# Altium schematic sheet MODULE_SAIL.SchDoc: MODULE SAIL
size A3; Author: Silvio Navaretti; CompanyName: ARDUINO; DrawnBy: Silvio Navaretti; Engineer: Silvio Navaretti; Organization: ARDUINO; SheetNumber: 4; SheetTotal: 51; RevAuthor: Silvio Navaretti
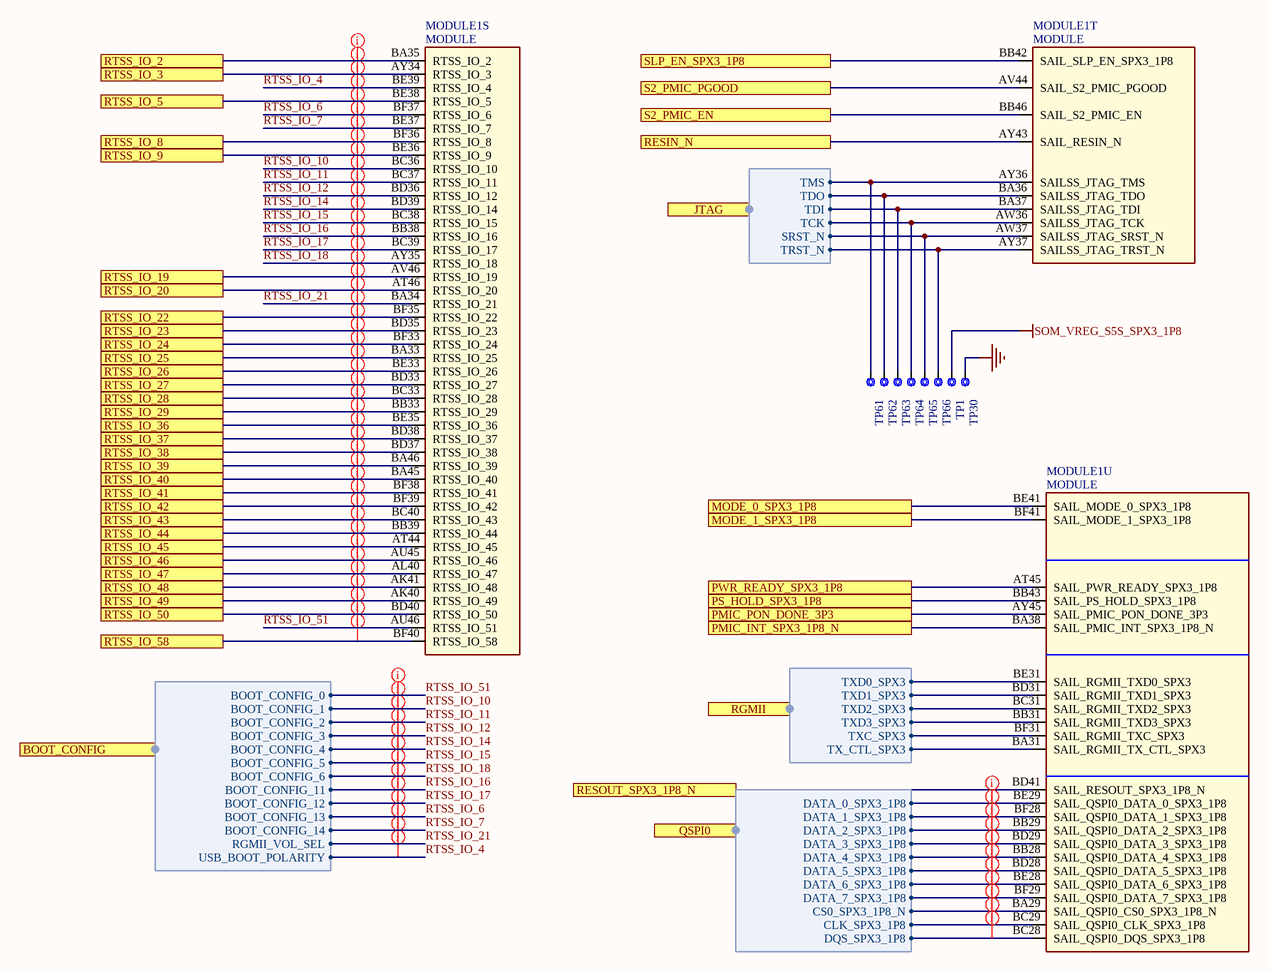
[diagram p0: MODULE_SAIL.SchDoc]

## Parts
MODULE1  MODULE  [MODULE]  (parts S,T,U of 22)
TP1  Test point 1.00mm  [TP-1.00MM]  (value not drawn)  (no BOM)
TP30  Test point 1.00mm  [TP-1.00MM]  (value not drawn)  (no BOM)
TP61  Test point 1.00mm  [TP-1.00MM]  (value not drawn)  (no BOM)
TP62  Test point 1.00mm  [TP-1.00MM]  (value not drawn)  (no BOM)
TP63  Test point 1.00mm  [TP-1.00MM]  (value not drawn)  (no BOM)
TP64  Test point 1.00mm  [TP-1.00MM]  (value not drawn)  (no BOM)
TP65  Test point 1.00mm  [TP-1.00MM]  (value not drawn)  (no BOM)
TP66  Test point 1.00mm  [TP-1.00MM]  (value not drawn)  (no BOM)

## Ports
BOOT_CONFIG (harness SOM_SAIL_BOOT_CONFIG), JTAG (harness SOM_SAIL_JTAG), MODE_0_SPX3_1P8, MODE_1_SPX3_1P8, PMIC_INT_SPX3_1P8_N, PMIC_PON_DONE_3P3, PS_HOLD_SPX3_1P8, PWR_READY_SPX3_1P8, QSPI0 (harness SOM_SAIL_QSPI0), RESIN_N, RESOUT_SPX3_1P8_N, RGMII (harness SOM_SAIL_RGMII), RTSS_IO_2, RTSS_IO_3, RTSS_IO_5, RTSS_IO_8, RTSS_IO_9, RTSS_IO_19, RTSS_IO_20, RTSS_IO_22, RTSS_IO_23, RTSS_IO_24, RTSS_IO_25, RTSS_IO_26, RTSS_IO_27, RTSS_IO_28, RTSS_IO_29, RTSS_IO_36, RTSS_IO_37, RTSS_IO_38, RTSS_IO_39, RTSS_IO_40, RTSS_IO_41, RTSS_IO_42, RTSS_IO_43, RTSS_IO_44, RTSS_IO_45, RTSS_IO_46, RTSS_IO_47, RTSS_IO_48, RTSS_IO_49, RTSS_IO_50, RTSS_IO_58, S2_PMIC_EN, S2_PMIC_PGOOD, SLP_EN_SPX3_1P8

## Harnesses
SOM_SAIL_JTAG: TMS, TDO, TDI, TCK, SRST_N, TRST_N
SOM_SAIL_RGMII: TXD0_SPX3, TXD1_SPX3, TXD2_SPX3, TXD3_SPX3, TXC_SPX3, TX_CTL_SPX3
SOM_SAIL_QSPI0: DATA_0_SPX3_1P8, DATA_1_SPX3_1P8, DATA_2_SPX3_1P8, DATA_3_SPX3_1P8, DATA_4_SPX3_1P8, DATA_5_SPX3_1P8, DATA_6_SPX3_1P8, DATA_7_SPX3_1P8, CS0_SPX3_1P8_N, CLK_SPX3_1P8, DQS_SPX3_1P8
SOM_SAIL_BOOT_CONFIG: BOOT_CONFIG_0, BOOT_CONFIG_1, BOOT_CONFIG_2, BOOT_CONFIG_3, BOOT_CONFIG_4, BOOT_CONFIG_5, BOOT_CONFIG_6, BOOT_CONFIG_11, BOOT_CONFIG_12, BOOT_CONFIG_13, BOOT_CONFIG_14, RGMII_VOL_SEL, USB_BOOT_POLARITY

## Nets
GND: TP30.X
SOM_VREG_S5S_SPX3_1P8: TP1.X
MODE_0_SPX3_1P8: MODULE1.BE41(SAIL_MODE_0_SPX3_1P8) ; port MODE_0_SPX3_1P8
MODE_1_SPX3_1P8: MODULE1.BF41(SAIL_MODE_1_SPX3_1P8) ; port MODE_1_SPX3_1P8
PMIC_INT_SPX3_1P8_N: MODULE1.BA38(SAIL_PMIC_INT_SPX3_1P8_N) ; port PMIC_INT_SPX3_1P8_N
PMIC_PON_DONE_3P3: MODULE1.AY45(SAIL_PMIC_PON_DONE_3P3) ; port PMIC_PON_DONE_3P3
PS_HOLD_SPX3_1P8: MODULE1.BB43(SAIL_PS_HOLD_SPX3_1P8) ; port PS_HOLD_SPX3_1P8
PWR_READY_SPX3_1P8: MODULE1.AT45(SAIL_PWR_READY_SPX3_1P8) ; port PWR_READY_SPX3_1P8
RESIN_N: MODULE1.AY43(SAIL_RESIN_N) ; port RESIN_N
RESOUT_SPX3_1P8_N: MODULE1.BD41(SAIL_RESOUT_SPX3_1P8_N) ; port RESOUT_SPX3_1P8_N
RTSS_IO_2: MODULE1.BA35(RTSS_IO_2) ; port RTSS_IO_2
RTSS_IO_3: MODULE1.AY34(RTSS_IO_3) ; port RTSS_IO_3
RTSS_IO_4: MODULE1.BE39(RTSS_IO_4) ; port BOOT_CONFIG.USB_BOOT_POLARITY
RTSS_IO_5: MODULE1.BE38(RTSS_IO_5) ; port RTSS_IO_5
RTSS_IO_6: MODULE1.BF37(RTSS_IO_6) ; port BOOT_CONFIG.BOOT_CONFIG_13
RTSS_IO_7: MODULE1.BE37(RTSS_IO_7) ; port BOOT_CONFIG.BOOT_CONFIG_14
RTSS_IO_8: MODULE1.BF36(RTSS_IO_8) ; port RTSS_IO_8
RTSS_IO_9: MODULE1.BE36(RTSS_IO_9) ; port RTSS_IO_9
RTSS_IO_10: MODULE1.BC36(RTSS_IO_10) ; port BOOT_CONFIG.BOOT_CONFIG_1
RTSS_IO_11: MODULE1.BC37(RTSS_IO_11) ; port BOOT_CONFIG.BOOT_CONFIG_2
RTSS_IO_12: MODULE1.BD36(RTSS_IO_12) ; port BOOT_CONFIG.BOOT_CONFIG_3
RTSS_IO_14: MODULE1.BD39(RTSS_IO_14) ; port BOOT_CONFIG.BOOT_CONFIG_4
RTSS_IO_15: MODULE1.BC38(RTSS_IO_15) ; port BOOT_CONFIG.BOOT_CONFIG_5
RTSS_IO_16: MODULE1.BB38(RTSS_IO_16) ; port BOOT_CONFIG.BOOT_CONFIG_11
RTSS_IO_17: MODULE1.BC39(RTSS_IO_17) ; port BOOT_CONFIG.BOOT_CONFIG_12
RTSS_IO_18: MODULE1.AY35(RTSS_IO_18) ; port BOOT_CONFIG.BOOT_CONFIG_6
RTSS_IO_19: MODULE1.AV46(RTSS_IO_19) ; port RTSS_IO_19
RTSS_IO_20: MODULE1.AT46(RTSS_IO_20) ; port RTSS_IO_20
RTSS_IO_21: MODULE1.BA34(RTSS_IO_21) ; port BOOT_CONFIG.RGMII_VOL_SEL
RTSS_IO_22: MODULE1.BF35(RTSS_IO_22) ; port RTSS_IO_22
RTSS_IO_23: MODULE1.BD35(RTSS_IO_23) ; port RTSS_IO_23
RTSS_IO_24: MODULE1.BF33(RTSS_IO_24) ; port RTSS_IO_24
RTSS_IO_25: MODULE1.BA33(RTSS_IO_25) ; port RTSS_IO_25
RTSS_IO_26: MODULE1.BE33(RTSS_IO_26) ; port RTSS_IO_26
RTSS_IO_27: MODULE1.BD33(RTSS_IO_27) ; port RTSS_IO_27
RTSS_IO_28: MODULE1.BC33(RTSS_IO_28) ; port RTSS_IO_28
RTSS_IO_29: MODULE1.BB33(RTSS_IO_29) ; port RTSS_IO_29
RTSS_IO_36: MODULE1.BE35(RTSS_IO_36) ; port RTSS_IO_36
RTSS_IO_37: MODULE1.BD38(RTSS_IO_37) ; port RTSS_IO_37
RTSS_IO_38: MODULE1.BD37(RTSS_IO_38) ; port RTSS_IO_38
RTSS_IO_39: MODULE1.BA46(RTSS_IO_39) ; port RTSS_IO_39
RTSS_IO_40: MODULE1.BA45(RTSS_IO_40) ; port RTSS_IO_40
RTSS_IO_41: MODULE1.BF38(RTSS_IO_41) ; port RTSS_IO_41
RTSS_IO_42: MODULE1.BF39(RTSS_IO_42) ; port RTSS_IO_42
RTSS_IO_43: MODULE1.BC40(RTSS_IO_43) ; port RTSS_IO_43
RTSS_IO_44: MODULE1.BB39(RTSS_IO_44) ; port RTSS_IO_44
RTSS_IO_45: MODULE1.AT44(RTSS_IO_45) ; port RTSS_IO_45
RTSS_IO_46: MODULE1.AU45(RTSS_IO_46) ; port RTSS_IO_46
RTSS_IO_47: MODULE1.AL40(RTSS_IO_47) ; port RTSS_IO_47
RTSS_IO_48: MODULE1.AK41(RTSS_IO_48) ; port RTSS_IO_48
RTSS_IO_49: MODULE1.AK40(RTSS_IO_49) ; port RTSS_IO_49
RTSS_IO_50: MODULE1.BD40(RTSS_IO_50) ; port RTSS_IO_50
RTSS_IO_51: MODULE1.AU46(RTSS_IO_51) ; port BOOT_CONFIG.BOOT_CONFIG_0
RTSS_IO_58: MODULE1.BF40(RTSS_IO_58) ; port RTSS_IO_58
S2_PMIC_EN: MODULE1.BB46(SAIL_S2_PMIC_EN) ; port S2_PMIC_EN
S2_PMIC_PGOOD: MODULE1.AV44(SAIL_S2_PMIC_PGOOD) ; port S2_PMIC_PGOOD
SLP_EN_SPX3_1P8: MODULE1.BB42(SAIL_SLP_EN_SPX3_1P8) ; port SLP_EN_SPX3_1P8
NetMODULE1_AW36: MODULE1.AW36(SAILSS_JTAG_TCK) TP64.X ; port JTAG.TCK
NetMODULE1_AW37: MODULE1.AW37(SAILSS_JTAG_SRST_N) TP65.X ; port JTAG.SRST_N
NetMODULE1_AY36: MODULE1.AY36(SAILSS_JTAG_TMS) TP61.X ; port JTAG.TMS
NetMODULE1_AY37: MODULE1.AY37(SAILSS_JTAG_TRST_N) TP66.X ; port JTAG.TRST_N
NetMODULE1_BA29: MODULE1.BA29(SAIL_QSPI0_CS0_SPX3_1P8_N) ; port QSPI0.CS0_SPX3_1P8_N
NetMODULE1_BA31: MODULE1.BA31(SAIL_RGMII_TX_CTL_SPX3) ; port RGMII.TX_CTL_SPX3
NetMODULE1_BA36: MODULE1.BA36(SAILSS_JTAG_TDO) TP62.X ; port JTAG.TDO
NetMODULE1_BA37: MODULE1.BA37(SAILSS_JTAG_TDI) TP63.X ; port JTAG.TDI
NetMODULE1_BB28: MODULE1.BB28(SAIL_QSPI0_DATA_4_SPX3_1P8) ; port QSPI0.DATA_4_SPX3_1P8
NetMODULE1_BB29: MODULE1.BB29(SAIL_QSPI0_DATA_2_SPX3_1P8) ; port QSPI0.DATA_2_SPX3_1P8
NetMODULE1_BB31: MODULE1.BB31(SAIL_RGMII_TXD3_SPX3) ; port RGMII.TXD3_SPX3
NetMODULE1_BC28: MODULE1.BC28(SAIL_QSPI0_DQS_SPX3_1P8) ; port QSPI0.DQS_SPX3_1P8
NetMODULE1_BC29: MODULE1.BC29(SAIL_QSPI0_CLK_SPX3_1P8) ; port QSPI0.CLK_SPX3_1P8
NetMODULE1_BC31: MODULE1.BC31(SAIL_RGMII_TXD2_SPX3) ; port RGMII.TXD2_SPX3
NetMODULE1_BD28: MODULE1.BD28(SAIL_QSPI0_DATA_5_SPX3_1P8) ; port QSPI0.DATA_5_SPX3_1P8
NetMODULE1_BD29: MODULE1.BD29(SAIL_QSPI0_DATA_3_SPX3_1P8) ; port QSPI0.DATA_3_SPX3_1P8
NetMODULE1_BD31: MODULE1.BD31(SAIL_RGMII_TXD1_SPX3) ; port RGMII.TXD1_SPX3
NetMODULE1_BE28: MODULE1.BE28(SAIL_QSPI0_DATA_6_SPX3_1P8) ; port QSPI0.DATA_6_SPX3_1P8
NetMODULE1_BE29: MODULE1.BE29(SAIL_QSPI0_DATA_0_SPX3_1P8) ; port QSPI0.DATA_0_SPX3_1P8
NetMODULE1_BE31: MODULE1.BE31(SAIL_RGMII_TXD0_SPX3) ; port RGMII.TXD0_SPX3
NetMODULE1_BF28: MODULE1.BF28(SAIL_QSPI0_DATA_1_SPX3_1P8) ; port QSPI0.DATA_1_SPX3_1P8
NetMODULE1_BF29: MODULE1.BF29(SAIL_QSPI0_DATA_7_SPX3_1P8) ; port QSPI0.DATA_7_SPX3_1P8
NetMODULE1_BF31: MODULE1.BF31(SAIL_RGMII_TXC_SPX3) ; port RGMII.TXC_SPX3

## Layout directives
net class NET_SOM_SAIL_BOOT: RTSS_IO_4, RTSS_IO_6, RTSS_IO_7, RTSS_IO_10, RTSS_IO_11, RTSS_IO_12, RTSS_IO_14, RTSS_IO_15, RTSS_IO_16, RTSS_IO_17, RTSS_IO_18, RTSS_IO_21, RTSS_IO_51
net class NET_SOM_SAIL_IO: RTSS_IO_2, RTSS_IO_3, RTSS_IO_4, RTSS_IO_5, RTSS_IO_6, RTSS_IO_7, RTSS_IO_8, RTSS_IO_9, RTSS_IO_10, RTSS_IO_11, RTSS_IO_12, RTSS_IO_14, RTSS_IO_15, RTSS_IO_16, RTSS_IO_17, RTSS_IO_18, RTSS_IO_19, RTSS_IO_20, RTSS_IO_21, RTSS_IO_22, RTSS_IO_23, RTSS_IO_24, RTSS_IO_25, RTSS_IO_26, RTSS_IO_27, RTSS_IO_28, RTSS_IO_29, RTSS_IO_36, RTSS_IO_37, RTSS_IO_38, RTSS_IO_39, RTSS_IO_40, RTSS_IO_41, RTSS_IO_42, RTSS_IO_43, RTSS_IO_44, RTSS_IO_45, RTSS_IO_46, RTSS_IO_47, RTSS_IO_48, RTSS_IO_49, RTSS_IO_50, RTSS_IO_51, RTSS_IO_58
net class NET_SOM_SAIL_QSPI0: NetMODULE1_BA29, NetMODULE1_BB28, NetMODULE1_BB29, NetMODULE1_BC28, NetMODULE1_BC29, NetMODULE1_BD28, NetMODULE1_BD29, NetMODULE1_BE28, NetMODULE1_BE29, NetMODULE1_BF28, NetMODULE1_BF29

## Notes on the sheet
- Title:
- ID:
- Date:
- Time:
- Version:
- Sheet
- of
- RevAuthor:
- Reference Designs ARE PROVIDED "AS IS" AND "WITH ALL FAULTS. Arduino SA DISCLAIMS ALL OTHER WARRANTIES, EXPRESS OR IMPLIED, REGARDING PRODUCTS, INCLUDING BUT NOT LIMITED TO, ANY IMPLIED WARRANTIES OF MERCHANTABILITY OR FITNESS FOR A PARTICULAR PURPOSE.
  Arduino SA may make changes to specifications and product descriptions at any time, without notice. The Customer must not rely on the absence or characteristics of any features or instructions marked "reserved" or "undefined".
  Arduino SA reserves these for future definition and shall have no responsibility whatsoever for conflicts or incompatibilities arising from future changes to them. The product information on the Web Site or Materials is subject to change without notice.
  Do not finalize a design with this info. ARDUINO and other Arduino brands and logos and Trademarks of Arduino SA. All Arduino SA Trademarks cannot be used without owner's formal permission.
- File:
- Author:

## Library data of the parts
MODULE1 = M0029-A.19: MODULE BGA 1883 balls 57.5x57.5mm; Manufacturer: Qualcomm; Code Arduino: M0029; Part Number: MODULE BGA; Pin Count: 1883
TP1 TP30 TP61-TP66 = UT0013-A.6: Part Number: This is not a component; Design Item ID: CMP-018-0005-A.3; Source: ut.SchLib; Manufacturer: This is not a component; Code Arduino: This is not a component; Pin Count: 1